# EAGLE design schematic-MAX6675 (EAGLE 6.2)
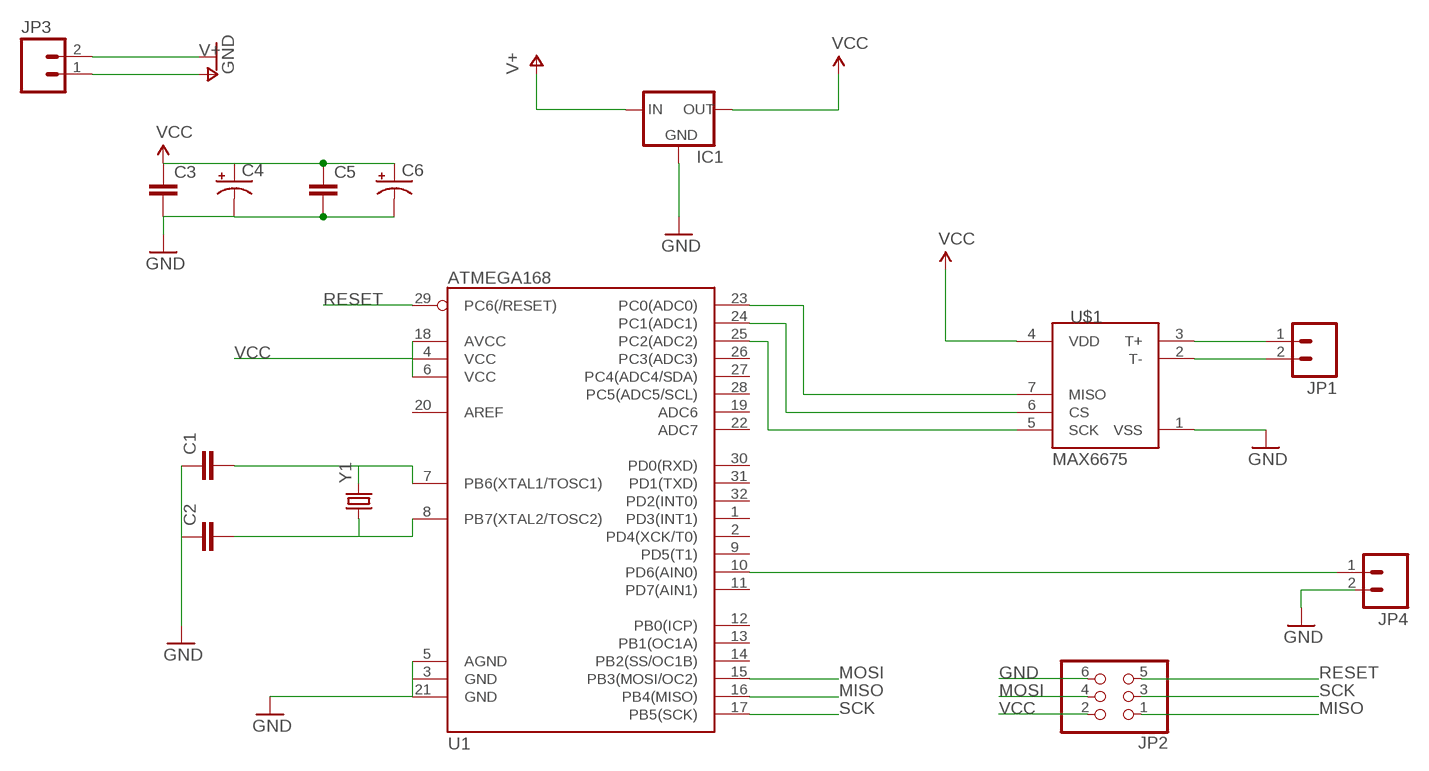
[diagram p0: schematic, sheet 1]

## Parts
C1  CAPPTH2  [CAP-PTH-SMALL2]
C2  CAPPTH2  [CAP-PTH-SMALL2]
C3  CAPPTH  [CAP-PTH-SMALL]
C4  CAP_POLPTH2  [CPOL-RADIAL-10UF-25V]
C5  CAPPTH  [CAP-PTH-SMALL]
C6  CAP_POLPTH2  [CPOL-RADIAL-10UF-25V]
IC1  V_REG_78XXSINK  [TO220-IGO]
JP1  M025MM  [SCREWTERMINAL-5MM-2]
JP2  PINHD-2X3  [2X03]
JP3  M023.5MM_LOCK  [SCREWTERMINAL-3.5MM-2_LOCK]
JP4  M023.5MM_LOCK  [SCREWTERMINAL-3.5MM-2_LOCK]
U1  ATMEGA168  [TQFP32-08]
U$1  MAX6675  [SO08-MAX6675]
Y1  CRYSTALHC49US  [HC49US]

## Nets
GND: C1.1 C2.1 C3.2 C4.2(-) C5.2 C6.2(-) IC1.GND JP2.6 JP3.2 U1.5(AGND) U1.21(GND) U$1.1(VSS)
MISO: JP2.1 U1.16(PB4(MISO))
MOSI: JP2.4 U1.15(PB3(MOSI/OC2))
N$1: JP1.1 U$1.3(T+)
N$2: C1.2 U1.7(PB6(XTAL1/TOSC1)) Y1.2
N$3: C2.2 U1.8(PB7(XTAL2/TOSC2)) Y1.1
N$4: JP1.2 U$1.2(T-)
N$6: U1.25(PC2(ADC2)) U$1.5(SCK)
N$7: U1.24(PC1(ADC1)) U$1.6(CS)
N$8: U1.23(PC0(ADC0)) U$1.7(MISO)
N$9: JP4.1 U1.10(PD6(AIN0))
RESET: JP2.5 U1.29(PC6(/RESET))
SCK: JP2.3 U1.17(PB5(SCK))
V+: IC1.IN JP3.1
VCC: C3.1 C4.1(+) C5.1 C6.1(+) IC1.OUT JP2.2 U1.4(VCC) U1.6(VCC) U1.18(AVCC) U$1.4(VDD)
Unconnected: JP4.2 U1.1(PD3(INT1)) U1.2(PD4(XCK/T0)) U1.3(GND) U1.9(PD5(T1)) U1.11(PD7(AIN1)) U1.12(PB0(ICP)) U1.13(PB1(OC1A)) U1.14(PB2(SS/OC1B)) U1.19(ADC6) U1.20(AREF) U1.22(ADC7) U1.26(PC3(ADC3)) U1.27(PC4(ADC4/SDA)) U1.28(PC5(ADC5/SCL)) U1.30(PD0(RXD)) U1.31(PD1(TXD)) U1.32(PD2(INT0))

## Library data of the parts
C1-C3 C5 = SparkFun:CAP: Capacitor Standard 0603 ceramic capacitor, and 0.1" leaded capacitor.
C4 C6 = SparkFun:CAP_POL: Capacitor Polarized These are standard SMD and PTH capacitors. Normally 10uF, 47uF, and 100uF in electrolytic and tantalum varieties. Always verify the external diameter of the through hole cap, it varies with capacity, voltage, and manufacturer. The EIA devices should be standard.
IC1 = SparkFun:V_REG_78XX: Voltage Regulator Standard 7805 5V regulator. IGO (Input Ground Output). Spark Fun Electronics SKU : COM-00107
JP1 JP3 JP4 = SparkFun:M02: Header 2 Standard 2-pin 0.1" header. Use with straight break away headers (SKU : PRT-00116), right angle break away headers (PRT-00553), swiss pins (PRT-00743), machine pins (PRT-00117), and female headers (PRT-00115). Molex polarized connector foot print use with SKU : PRT-08233 with associated crimp pins and housings.
JP2 = SparkFun:PINHD-2X3: PIN HEADER
U1 = SparkFun:ATMEGA168
U$1 = SparkFun:MAX6675
Y1 = SparkFun:CRYSTAL: Crystals Various standard crystals. Proven footprints. Spark Fun Electronics SKU : COM-00534

## Board
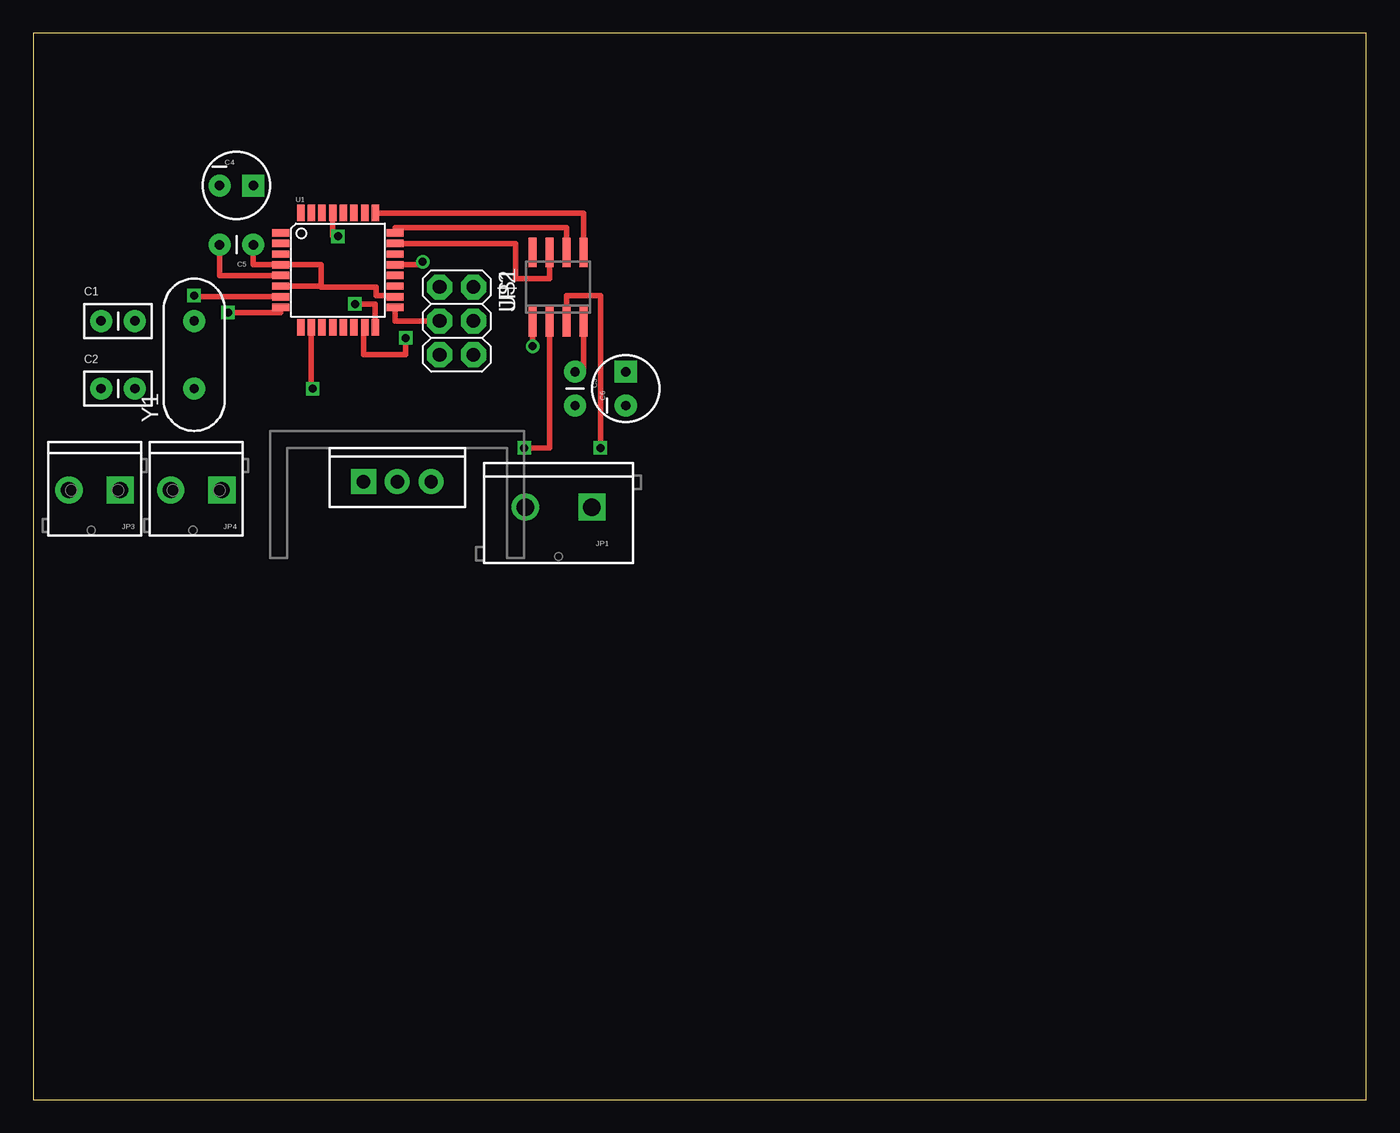
[diagram p1: board, top side]
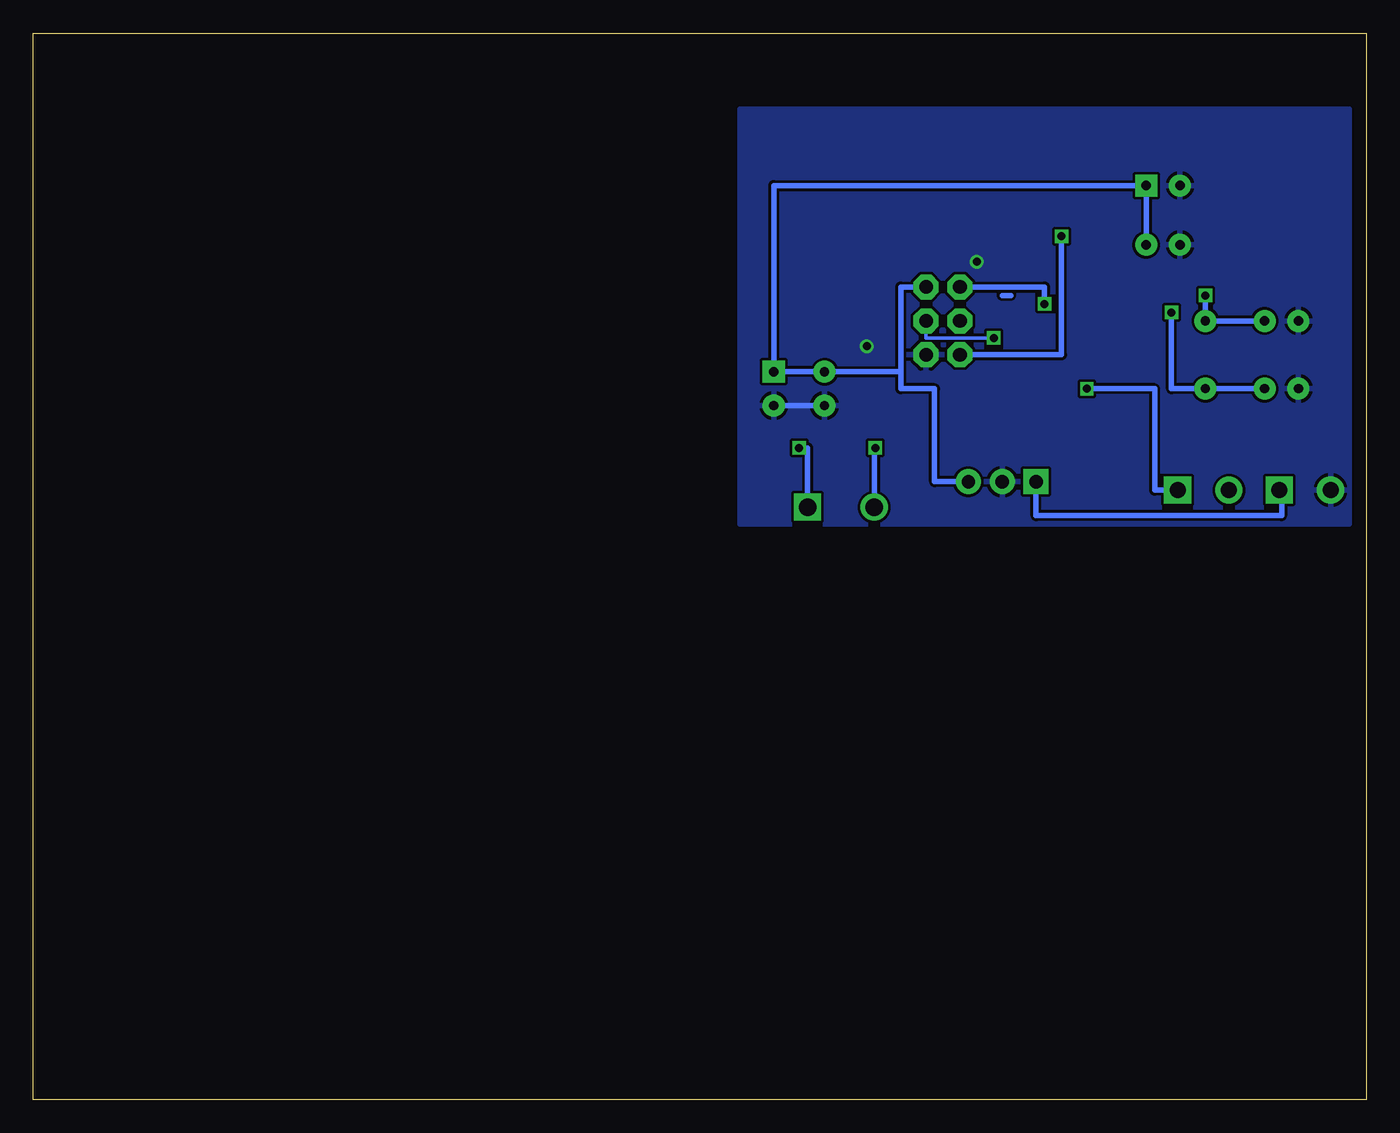
[diagram p2: board, bottom side, seen from below]

Size 100 x 80 mm. Coordinates in mm from the lower left corner, seen from the top.
Outline: 0,0 100,0 100,80 0,80 0,0
Copper layers (1*16): Top 0.035mm / dielectric 1.5mm / Bottom 0.035mm
Design rules: minimum track width 10mil, minimum drill 24mil, track to track 8mil, track to pad 8mil, pad to pad 8mil, via to via 8mil, smd to smd 8mil, copper to edge 40mil, drill to drill 8mil, minimum pad ring 10mil, minimum via ring 8mil, stop-mask expansion 4mil, vias tented up to drill 0mil, thermal gap 10mil

### Footprints (pad centres in the part's own frame; a part is rotated, then mirrored left to right if it is on the bottom)
CAP-PTH-SMALL2 = drill 0.7 pad 1.651: 1 0,0; 2 2.54,0
CAP-PTH-SMALL = drill 0.7 pad 1.651: 1 0,0; 2 2.54,0
CPOL-RADIAL-10UF-25V = drill 0.7 pad 1.651 square: 1 1.27,0 | drill 0.7 pad 1.651: 2 -1.27,0
TO220-IGO = drill 1 pad 1.88: GND 0,0; OUT 2.54,0 | drill 1 pad 1.88 square: IN -2.54,0
SCREWTERMINAL-5MM-2 = drill 1.3 pad 2.032 square: 1 0,0 | drill 1.3 pad 2.032: 2 5,0
2X03 = drill 1.016 pad 1.88 octagon: 1 -2.54,-1.27; 2 -2.54,1.27; 3 0,-1.27; 4 0,1.27; 5 2.54,-1.27; 6 2.54,1.27
SCREWTERMINAL-3.5MM-2_LOCK = drill 1.2 pad 2.032 square: 1 -0.178,0 | drill 1.2 pad 2.032: 2 3.678,0
TQFP32-08 = smd 1.27 x 0.559: 1 -4.293,2.8; 2 -4.293,2; 3 -4.293,1.2; 4 -4.293,0.4; 5 -4.293,-0.4; 6 -4.293,-1.2; 7 -4.293,-2; 8 -4.293,-2.8; 17 4.293,-2.8; 18 4.293,-2; 19 4.293,-1.2; 20 4.293,-0.4; 21 4.293,0.4; 22 4.293,1.2; 23 4.293,2; 24 4.293,2.8 | smd 0.559 x 1.27: 9 -2.8,-4.293; 10 -2,-4.293; 11 -1.2,-4.293; 12 -0.4,-4.293; 13 0.4,-4.293; 14 1.2,-4.293; 15 2,-4.293; 16 2.8,-4.293; 25 2.8,4.293; 26 2,4.293; 27 1.2,4.293; 28 0.4,4.293; 29 -0.4,4.293; 30 -1.2,4.293; 31 -2,4.293; 32 -2.8,4.293
SO08-MAX6675 = smd 0.6 x 2.2: 1 -1.905,-2.6; 2 -0.635,-2.6; 3 0.635,-2.6; 4 1.905,-2.6; 5 1.905,2.6; 6 0.635,2.6; 7 -0.635,2.6; 8 -1.905,2.6
HC49US = drill 0.7 pad 1.651: 1 -2.54,0; 2 2.54,0

### Placement (x,y rotation side)
C1  5.08,58.42 0 top
C2  5.08,53.34 0 top
C3  40.64,54.61 270 top
C4  15.24,68.58 0 top
C5  16.51,64.14 180 top
C6  44.45,53.34 90 top
IC1  27.3,46.35 0 top
JP1  41.91,44.45 180 top
JP2  31.75,58.42 270 top
JP3  6.35,45.72 180 top
JP4  13.97,45.72 180 top
U1  22.86,62.23 0 top
U$1  39.37,60.96 0 top
Y1  12.06,55.88 90 top

### Tracks (layer width: path | path; a pad name or v marks a point on that pad's centre or on a via)
GND  (via drill 0.6)
  Top 0.406: U1.5 13.97,61.83 C5.2 | U1.21 29.21,62.63 v29.21,62.87 | U$1.1 v37.47,56.52
  Bottom 0.406: C3.2 C6.2
  pour Bottom: 1.27,74.3 46.99,74.3 46.99,43.18 1.27,43.18
MISO  (via drill 0.6)
  Top 0.406: v24.13,59.69 25.66,59.69 U1.16
  Bottom 0.406: JP2.1 24.13,60.96 v24.13,59.69
MOSI  (via drill 0.6)
  Top 0.406: U1.15 24.77,57.94 24.77,55.88 27.94,55.88 v27.94,57.15
  Bottom 0.254: v27.94,57.15 33.02,57.15 JP2.4
N$1  (via drill 0.6)
  Top 0.406: U$1.3 40.01,60.33 42.55,60.33 v42.55,48.9
  Bottom 0.406: v42.55,48.9 41.91,48.9 JP1.1
N$2  (via drill 0.6)
  Top 0.406: U1.7 12.06,60.23 v12.06,60.33
  Bottom 0.406: C1.2 Y1.2 v12.06,60.33
N$3  (via drill 0.6)
  Top 0.406: v14.61,59.05 18.57,59.05 U1.8
  Bottom 0.406: C2.2 Y1.1 14.61,53.34 v14.61,59.05
N$4  (via drill 0.6)
  Top 0.406: U$1.2 38.73,48.9 v36.83,48.9
  Bottom 0.406: v36.83,48.9 36.91,48.9 JP1.2
N$5
  Bottom 0.406: 26.67,60.33 27.3,60.33
N$6
  Top 0.406: U1.25 41.27,66.52 U$1.5
N$7
  Top 0.406: U$1.6 40.01,65.41 27.15,65.41 U1.24
N$8
  Top 0.406: U1.23 36.2,64.23 36.2,61.59 38.73,61.59 U$1.7
N$9  (via drill 0.6)
  Top 0.406: v20.95,53.34 20.86,53.34 U1.10
  Bottom 0.406: JP4.1 15.88,45.72 15.88,53.34 v20.95,53.34
RESET  (via drill 0.6)
  Top 0.406: v22.86,64.77 22.46,64.77 U1.29
  Bottom 0.406: JP2.5 22.86,55.88 v22.86,64.77
SCK
  Top 0.406: JP2.3 27.15,58.42 U1.17
V+
  Bottom 0.406: JP3.1 6.35,45.72 6.35,43.81 24.77,43.81 IC1.IN
VCC
  Top 0.406: U$1.4 41.27,54.61 C3.1 | U1.6 21.59,61.03 | U1.18 27.15,60.33 25.72,60.33 25.72,60.96 21.59,60.96 21.59,61.03 | C5.1 16.51,62.63 U1.4 21.59,62.63 21.59,61.03
  Bottom 0.406: IC1.OUT 32.38,46.35 32.38,53.34 34.92,53.34 34.92,54.61 | 34.92,54.61 34.92,60.96 JP2.2 | C5.1 C4.1 44.45,68.58 C6.1 C3.1 34.92,54.61